# Altium schematic sheet BUT.SchDoc
size A; SheetNumber: 6; SheetTotal: 6
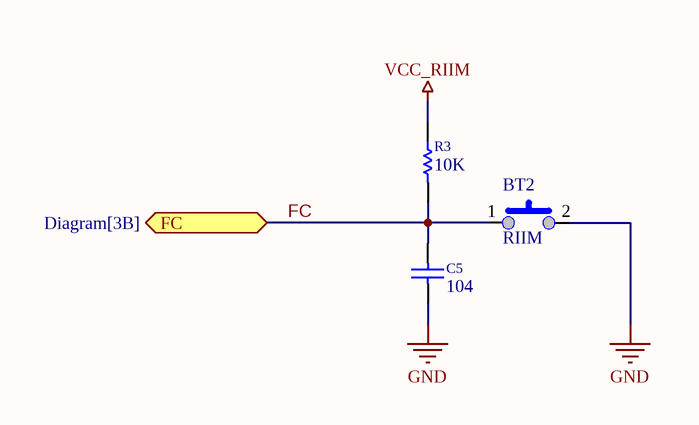
[diagram p0: BUT.SchDoc]

## Parts
BT2  RIIM  [B3U-1000P]
C5  104  [C2012-0805]
R3  10K  [R2012-0805]

## Ports
FC (bidir, see Diagram[3B])

## Nets
GND: BT2.2 C5.2
VCC_RIIM: R3.1
FC: BT2.1 C5.1 R3.2 ; port FC

## Library data of the parts
BT2 = Button_2p
C5 = Cap <SMD>: Capacitor; AEMS Code: 2100341; Vendor: Digikey; Volt: 16V; Published: 13-April-2009; Publisher: Hoang Nguyen; ComponentLink1Description: Digikey Part Link; ComponentLink2Description: Open Datasheet; ComponentLink2URL: H:\LIBRARY\LIBRARY.Datasheet\; Value: 104
R3 = Resistor <SMD>: Resistor; AEMS Code: 1200430; Vendor: Digikey; Tollerance: 5%; Published: 17-3-2009; Publisher: Hoang Nguyen; ComponentLink1Description: Digikey Part Link; ComponentLink2Description: Open Datasheet; ComponentLink2URL: H:\LIBRARY\LIBRARY.Datasheet\; Value: 10K